# EAGLE design ECE411 Rough Draft Schematic (EAGLE 9.6.2)
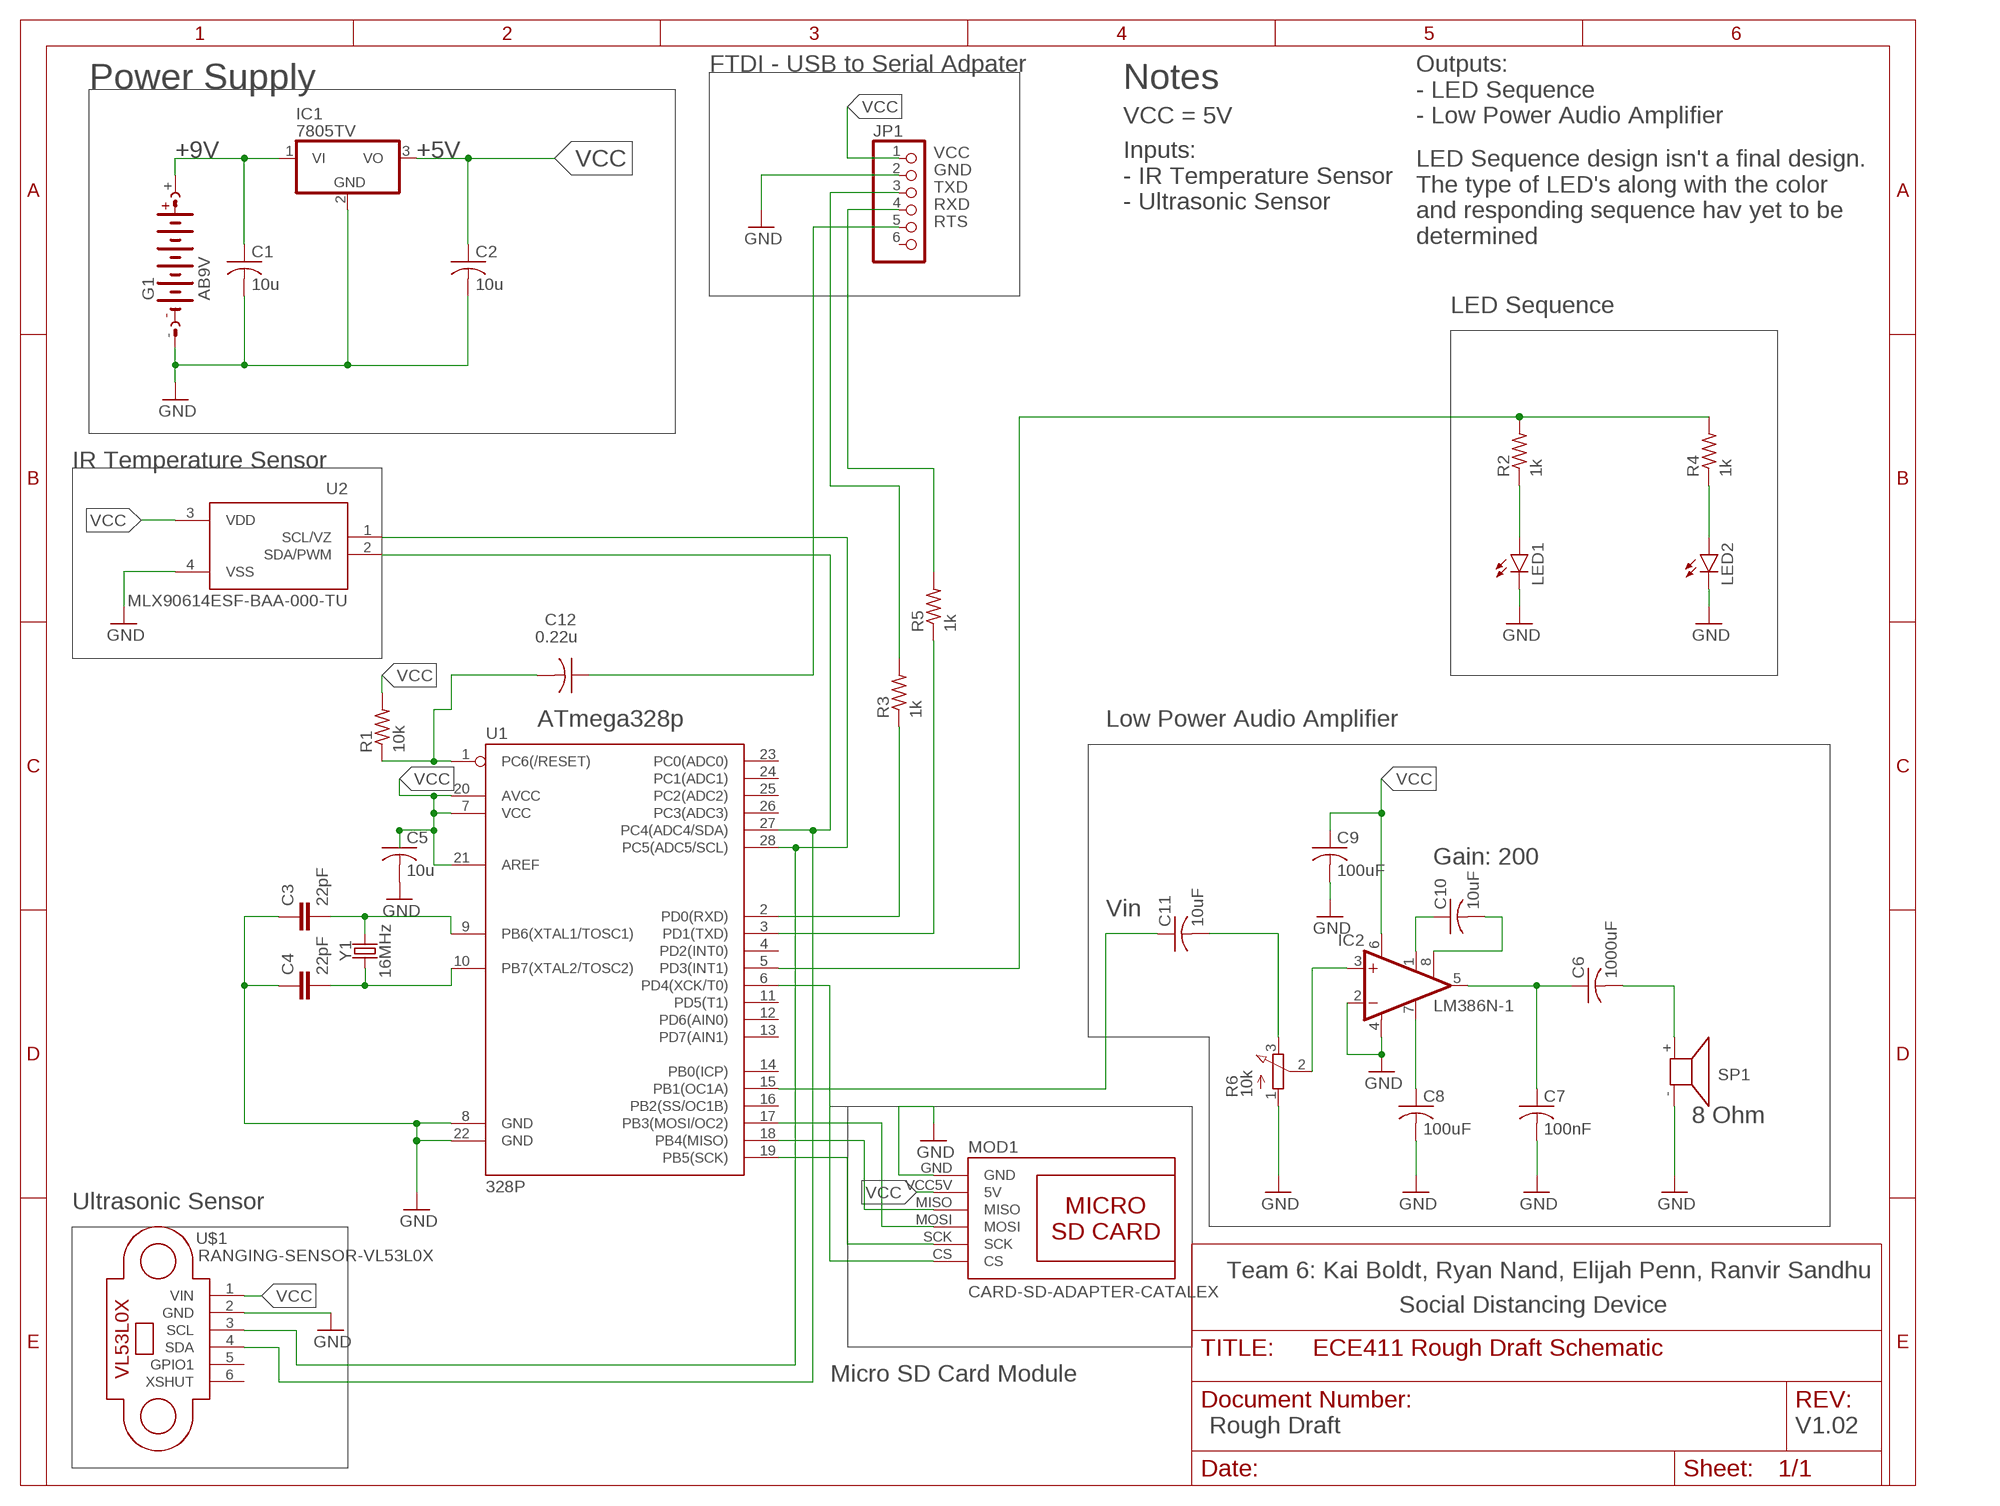
[diagram p0: schematic, sheet 1]

## Parts
C1  10u  C-US025-024X044  [C025-024X044]
C2  10u  C-US025-024X044  [C025-024X044]
C3  22pF  22PF-PTH-2.54MM-200V-5%  [CAP-PTH-2.54]
C4  22pF  22PF-PTH-2.54MM-200V-5%  [CAP-PTH-2.54]
C5  10u  C-US025-024X044  [C025-024X044]
C6  1000uF  C-US025-024X044  [C025-024X044]
C7  100nF  C-US025-024X044  [C025-024X044]
C8  100uF  C-US025-024X044  [C025-024X044]
C9  100uF  C-US025-024X044  [C025-024X044]
C10  10uF  C-US025-024X044  [C025-024X044]
C11  10uF  C-US025-024X044  [C025-024X044]
C12  0.22u  C-US050-030X075  [C050-030X075]
G1  AB9V  [AB9V]
IC1  7805TV  [TO220V]
IC2  LM386N-1  [DIL08]
JP1  PINHD-1X6  [1X06]
LED1  LED3MM  [LED3MM]
LED2  LED3MM  [LED3MM]
MOD1  CARD-SD-ADAPTER-CATALEX  [CARD-SD-ADAPTER-CATALEX]
R1  10k  R-US_0204/7  [0204/7]
R2  1k  R-US_0204/5  [0204/5]
R3  1k  R-US_0204/5  [0204/5]
R4  1k  R-US_0204/5  [0204/5]
R5  1k  R-US_0204/5  [0204/5]
R6  10k  3RP/1610N  [3RP/1610N]
SP1  KSS1201  [KSS1201]
U1  328P  ATMEGA328P_PDIP  [DIP28]
U2  MLX90614ESF-BAA-000-TU  [TO254P942H425-4]
U$1  RANGING-SENSOR-VL53L0X  [RANGING-SENSOR-VL53L0X]
Y1  16MHz  CRYSTAL-16MHZPTH-HC49US  [HC49US]

## Nets
+9V: C1.1 G1.+ IC1.1(VI)
CS: MOD1.CS U1.6(PD4(XCK/T0))
GND: C1.2 C2.2 C3.1 C4.1 C5.2 C7.2 C8.2 C9.2 G1.- IC1.2(GND) IC2.2(-IN) IC2.4(GND) JP1.2 LED1.K(C) LED2.K(C) MOD1.GND R6.1(A) SP1.- U1.8(GND) U1.22(GND) U2.4(VSS) U$1.2(GND)
MISO: MOD1.MISO U1.18(PB4(MISO))
MOSI: MOD1.MOSI U1.17(PB3(MOSI/OC2))
N$1: C3.2 U1.9(PB6(XTAL1/TOSC1)) Y1.2
N$2: C12.2 R1.1 U1.1(PC6(/RESET))
N$3: C4.2 U1.10(PB7(XTAL2/TOSC2)) Y1.1
N$8: C8.1 IC2.7(BYPASS)
N$9: C6.1 C7.1 IC2.5(OUT)
N$10: C10.2 IC2.8(GAIN)
N$11: IC2.3(+IN) R6.2(S)
N$12: C10.1 IC2.1(GAIN)
N$13: C11.2 R6.3(E)
N$14: C11.1 U1.15(PB1(OC1A))
N$20: R2.2 R4.2 U1.5(PD3(INT1))
N$21: LED1.A R2.1
N$22: LED2.A R4.1
N$23: R3.1 U1.2(PD0(RXD))
RTS: C12.1 JP1.5
RXD: JP1.4 R5.1 R5.2 U1.3(PD1(TXD))
SCK: MOD1.SCK U1.19(PB5(SCK))
SCL: U1.28(PC5(ADC5/SCL)) U2.1(SCL/VZ) U$1.3(SCL)
SDA: U1.27(PC4(ADC4/SDA)) U2.2(SDA/PWM) U$1.4(SDA)
TXD: JP1.3 R3.2
VCC: C2.1 C5.1 C9.1 IC1.3(VO) IC2.6(VS) JP1.1 MOD1.VCC5V(5V) R1.2 U1.7(VCC) U1.20(AVCC) U1.21(AREF) U2.3(VDD) U$1.1(VIN)
VO: C6.2 SP1.+
Unconnected: JP1.6 U1.4(PD2(INT0)) U1.11(PD5(T1)) U1.12(PD6(AIN0)) U1.13(PD7(AIN1)) U1.14(PB0(ICP)) U1.16(PB2(SS/OC1B)) U1.23(PC0(ADC0)) U1.24(PC1(ADC1)) U1.25(PC2(ADC2)) U1.26(PC3(ADC3)) U$1.5(GPIO1) U$1.6(XSHUT)

## Notes on the sheet
- FTDI - USB to Serial Adpater
- Power Supply | Notes
- VCC = 5V
- Outputs:
  - LED Sequence
  - Low Power Audio Amplifier
- +5V | VCC
- GND
- TXD
- RXD
- Inputs:
  - IR Temperature Sensor
  - Ultrasonic Sensor
- RTS
- LED Sequence design isn't a final design.
  The type of LED's along with the color 
  and responding sequence hav yet to be 
  determined
- LED Sequence
- IR Temperature Sensor
- ATmega328p | Low Power Audio Amplifier
- Gain: 200
- Vin
- 8 Ohm
- Ultrasonic Sensor
- Team 6: Kai Boldt, Ryan Nand, Elijah Penn, Ranvir Sandhu
- Social Distancing Device
- Micro SD Card Module
- Rough Draft | V1.02

## Library data of the parts
C1 C2 C5-C12 = rcl:C-US: CAPACITOR, American symbol; SPICEPREFIX: C
C3 C4 = SparkFun-Capacitors:22PF: 22pF ceramic capacitors A capacitor is a passive two-terminal electrical component used to store electrical energy temporarily in an electric field.; PROD_ID: CAP-09128
G1 = battery:AB9V: 9-V BATTERY CLIP
IC1 = linear:78*: Positive VOLTAGE REGULATOR Source: http://cache.national.com/ds/LM/LM78L05.pdf http://www.fairchildsemi.com/ds/LM/LM7805.pdf
IC2 = linear:LM386?-*: Low Voltage Audio Power Amplifier Source: http://cache.national.com/ds/LM/LM386.pdf
JP1 = pinhead:PINHD-1X6: PIN HEADER
LED1 LED2 = led:LED: LED OSRAM: - CHIPLED LG R971, LG N971, LY N971, LG Q971, LY Q971, LO R971, LY R971 LH N974, LH R974 LS Q976, LO Q976, LY Q976 LO Q996 - Hyper CHIPLED LW Q18S LB Q993, LB Q99A, LB R99A - SideLED LS A670, LO A670, LY A670, LG A670, LP A670 LB A673, LV A673, LT A673, LW A673 LH A674 LY A675 LS A676, LA A676, LO A676, LY A676, LW A676 LS A679, LY A679, LG A679 - Hyper Micro SIDELED® LS Y876, LA Y876, LO Y876, LY Y876 LT Y87S - SmartLED LW L88C, LW L88S LB L89C, LB L89S, LG L890 LS L89K, LO L89K, LY L89K LS L896, LA L896, LO L896, LY L896 - TOPLED LS T670, LO T670, LY T670, LG T670, LP T670 LSG T670, LSP T670, LSY T670, LOP T670, LYG T670 LG T671, LOG T671, LSG T671 LB T673, LV T673, LT T673, LW T673 LH T674 LS T676, LA T676, LO T676, LY T676, LB T676, LH T676, LSB T676, LW T676 LB T67C, LV T67C, LT T67C, LS T67K, LO T67K, LY T67K, LW E67C LS E67B, LA E67B, LO E67B, LY E67B, LB E67C, LV E67C, LT E67C LW T67C LS T679, LY T679, LG T679 LS T770, LO T770, LY T770, LG T770, LP T770 LB T773, LV T773, LT T773, LW T773 LH T774 LS E675, LA E675, LY E675, LS T675 LS T776, LA T776, LO T776, LY T776, LB T776 LHGB T686 LT T68C, LB T68C - Hyper Mini TOPLED® LB M676 - Mini TOPLED Santana® LG M470 LS M47K, LO M47K, LY M47K Source: http://www.osram.convergy.de LUXEON: - LUMILED® LXK2-PW12-R00, LXK2-PW12-S00, LXK2-PW14-U00, LXK2-PW14-V00 LXK2-PM12-R00, LXK2-PM12-S00, LXK2-PM14-U00 LXK2-PE12-Q00, LXK2-PE12-R00, LXK2-PE12-S00, LXK2-PE14-T00, LXK2-PE14-U00 LXK2-PB12-K00, LXK2-PB12-L00, LXK2-PB12-M00, LXK2-PB14-N00, LXK2-PB14-P00, LXK2-PB14-Q00 LXK2-PR12-L00, LXK2-PR12-M00, LXK2-PR14-Q00, LXK2-PR14-R00 LXK2-PD12-Q00, LXK2-PD12-R00, LXK2-PD12-S00 LXK2-PH12-R00, LXK2-PH12-S00 LXK2-PL12-P00, LXK2-PL12-Q00, LXK2-PL12-R00 Source: www.luxeon.com KINGBRIGHT: KA-3528ASYC Source: www.kingbright.com
MOD1 = SD-Card-Module_CATALEX:CARD-SD-ADAPTER-CATALEX: Micro SD Card Adapter Module with onboard 3.3V regulator
R1-R5 = rcl:R-US_: RESISTOR, American symbol; SPICEPREFIX: R
R6 = pot:3RP/1610N: 16mm Potentiometer one level Source: http://www.alphapotentiometers.net/html/16mm_pot_2.html
SP1 = buzzer:KSS1201: SPEAKER Source: Schukat; OC_FARNELL: unknown; OC_NEWARK: unknown
U1 = SparkFun-IC-Microcontroller:ATMEGA328P_PDIP: Atmel 328P Through hole ATMEGA328P uC used in the Arduino 32kb flash, 1k EEPROM, 2k SRAM Datasheet <http://www.sparkfun.com/datasheets/Components/SMD/ATMega328.pdf> SparkFun Products Storefront component: AVR 28 Pin 20MHz 32K 6A/D - ATMega328P <https://www.sparkfun.com/products/9061> (COM-09061) SparkFun Simon Says - Through-Hole Soldering Kit <https://www.sparkfun.com/products/10547> (KIT-10547) SparkFun Learn to Solder - Simon Says <https://www.sparkfun.com/products/13708> (KIT-13708) SparkFun BigTime Watch Kit <https://www.sparkfun.com/products/11734> (KIT-11734) SparkFun ClockIt <https://www.sparkfun.com/products/10930> (KIT-10930) SparkFun Serial Enabled LCD Kit <https://www.sparkfun.com/products/10097> (LCD-10097) SparkFun Simon Tilts - Through Hole Soldering Kit <https://www.sparkfun.com/products/12634> (KIT-12634) SparkFun Frequency Counter Kit <https://www.sparkfun.com/products/10140> (KIT-10140) FabFM Radio Kit <https://www.sparkfun.com/products/11043> (KIT-11043) SparkFun Binary Blaster Kit <https://www.sparkfun.com/products/12037> (KIT-12037) SparkFun Metro-Gnome <https://www.sparkfun.com/products/9236> (KIT-09236) ATmega328 with Arduino Optiboot (Uno) <https://www.sparkfun.com/products/10524> (DEV-10524); PROD_ID: IC-09136
U2 = MLX90614ESF-BAA-000-TU:MLX90614ESF-BAA-000-TU: Temperature Sensor Digital, Infrared (IR) -40°C ~ 85°C 16 b TO-39 Check prices <https://pricing.snapeda.com/parts/MLX90614ESF-BAA-000-TU/Melexis/view-part?ref=eda>; AVAILABILITY: Warning; DESCRIPTION: Temperature Sensor Digital, Infrared (IR) -40°C ~ 85°C 16 b TO-39; MF: Melexis; MP: MLX90614ESF-BAA-000-TU; PACKAGE: TO-39 Melexis; PRICE: None; PURCHASE-URL: https://pricing.snapeda.com/search/part/MLX90614ESF-BAA-000-TU/?ref=eda
U$1 = VL53L0X:RANGING-SENSOR-VL53L0X: Laser Ranging Sensor based on VL53L0X device More information about VL53L0X device can be found here: http://www.st.com/en/imaging-and-photonics-solutions/vl53l0x.html Arduino Library for VL53L0X is available here: https://github.com/pololu/vl53l0x-arduino Click here to find device on ebay.com <http://www.ebay.com/sch/GY+VL53L0X+module> Note: There are many variants. Search for the proper version.
Y1 = SparkFun-Clocks:CRYSTAL-16MHZ: 16MHz Crystal Digikey Example <http://www.digikey.com/product-search/en?keywords=535-9122-1-ND> Frequency: 16MHz Frequency Stability: ±50ppm Frequency Tolerance: ±20ppm Load Capacitance: 18pF SparkFun Products: Pro Micro -5V/16MHz <https://www.sparkfun.com/products/12640> SparkFun Serial Enabled LCD Kit <https://www.sparkfun.com/products/10097>; PROD_ID: XTAL-08181; SF_ID: COM-00536

## Board
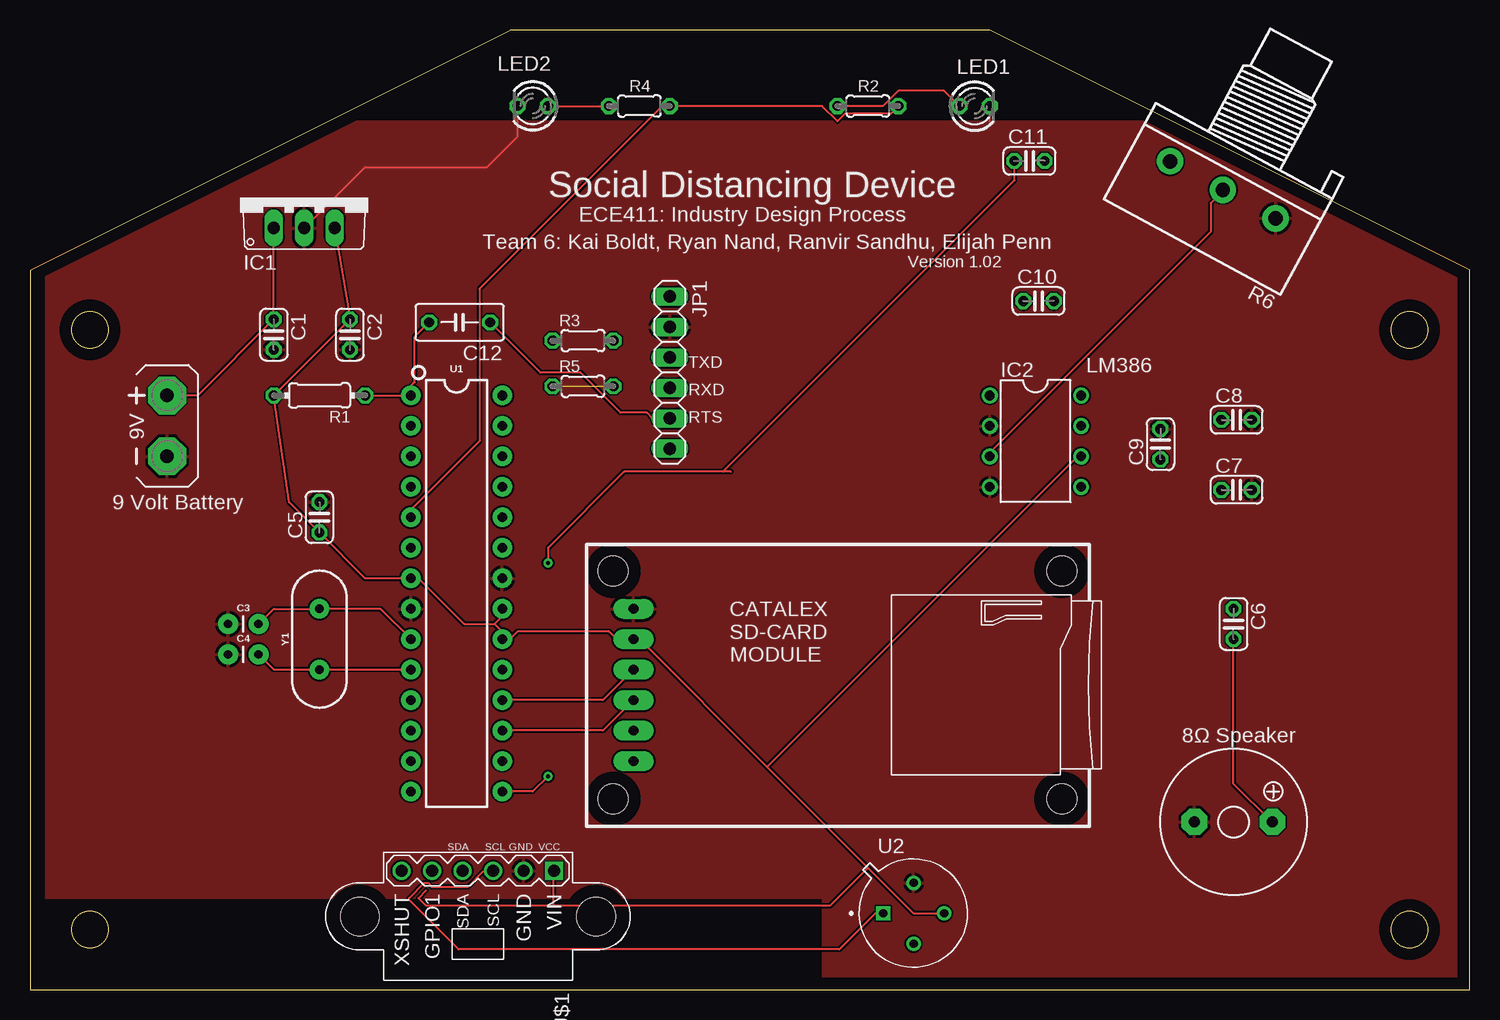
[diagram p1: board, top side]
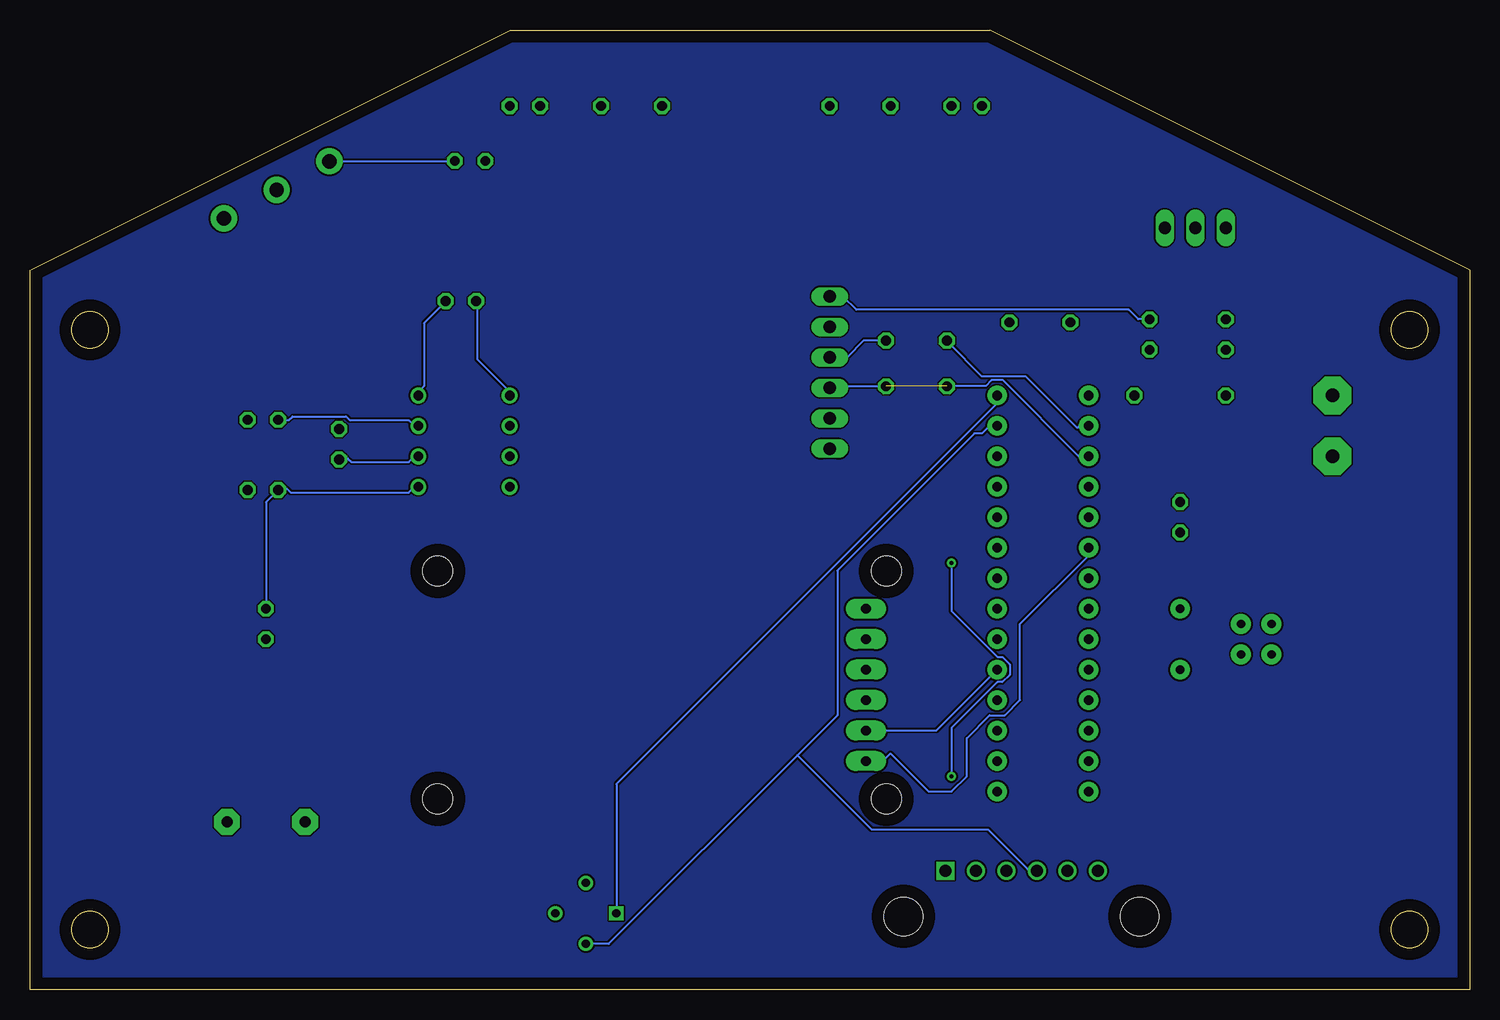
[diagram p2: board, bottom side, seen from below]

Size 120 x 80 mm. Coordinates in mm from the lower left corner, seen from the top.
Outline: 0,60 0,0 120,0 120,60 80,80 40,80 0,60
Outline: circle at 115,55 radius 1.5
Outline: circle at 5,55 radius 1.5
Outline: circle at 115,5 radius 1.5
Outline: circle at 5,5 radius 1.5
Copper layers (1*16): Top 0.035mm / dielectric 1.5mm / Bottom 0.035mm
Design rules "default": minimum track width 6mil, minimum drill 0.35mm, track to track 6mil, track to pad 6mil, pad to pad 6mil, via to via 6mil, smd to smd 6mil, copper to edge 40mil, drill to drill 6mil, minimum pad ring 10mil, minimum via ring 8mil, stop-mask expansion 4mil, vias tented up to drill 0mil, thermal gap 10mil

### Footprints (pad centres in the part's own frame; a part is rotated, then mirrored left to right if it is on the bottom)
C025-024X044 = drill 0.813 octagon: 1 -1.27,0; 2 1.27,0
CAP-PTH-2.54 = drill 0.7 pad 1.651: 1 -1.27,0; 2 1.27,0
C050-030X075 = drill 0.813 octagon: 1 -2.54,0; 2 2.54,0
AB9V = drill 1.118 pad 3.15 octagon: + 0,2.54; - 0,-2.54
TO220V = drill 1.016 long: 1 -2.54,-2.54; 2 0,-2.54; 3 2.54,-2.54
DIL08 = drill 0.813 pad 1.27: 1 -3.81,-3.81; 2 -1.27,-3.81; 3 1.27,-3.81; 4 3.81,-3.81; 5 3.81,3.81; 6 1.27,3.81; 7 -1.27,3.81; 8 -3.81,3.81
1X06 = drill 1.016 long: 1 -6.35,0; 2 -3.81,0; 3 -1.27,0; 4 1.27,0; 5 3.81,0; 6 6.35,0
LED3MM = drill 0.813 octagon: A -1.27,0; K 1.27,0
CARD-SD-ADAPTER-CATALEX = drill 0.8 pad 1.676 long: CS -17,-6.35; GND -17,6.35; MISO -17,1.27; MOSI -17,-1.27; SCK -17,-3.81; VCC5V -17,3.81 | hole 2.5: -18.7,9.5; 18.7,9.5; 18.7,-9.5; -18.7,-9.5
0204/7 = drill 0.813 octagon: 1 -3.81,0; 2 3.81,0
0204/5 = drill 0.813 octagon: 1 -2.54,0; 2 2.54,0
3RP/1610N = drill 1.2 pad 2.184: 1 -5,0; 2 0,0; 3 5,0
KSS1201 = drill 0.914 pad 2.159 octagon: + 3.251,0; - -3.251,0
DIP28 = drill 0.813 pad 1.626: 1 -16.51,-3.81; 2 -13.97,-3.81; 3 -11.43,-3.81; 4 -8.89,-3.81; 5 -6.35,-3.81; 6 -3.81,-3.81; 7 -1.27,-3.81; 8 1.27,-3.81; 9 3.81,-3.81; 10 6.35,-3.81; 11 8.89,-3.81; 12 11.43,-3.81; 13 13.97,-3.81; 14 16.51,-3.81; 15 16.51,3.81; 16 13.97,3.81; 17 11.43,3.81; 18 8.89,3.81; 19 6.35,3.81; 20 3.81,3.81; 21 1.27,3.81; 22 -1.27,3.81; 23 -3.81,3.81; 24 -6.35,3.81; 25 -8.89,3.81; 26 -11.43,3.81; 27 -13.97,3.81; 28 -16.51,3.81
TO254P942H425-4 = drill 0.69 pad 1.09 square: 1 -2.54,0 | drill 0.69 pad 1.09: 2 0,-2.54; 3 2.54,0; 4 0,2.54
RANGING-SENSOR-VL53L0X = drill 1 square: 1 -3.81,6.35 | drill 1: 2 -3.81,3.81; 3 -3.81,1.27; 4 -3.81,-1.27; 5 -3.81,-3.81; 6 -3.81,-6.35 | hole 3.2: 0,9.85; 0,-9.85
HC49US = drill 0.7 pad 1.651: 1 -2.54,0; 2 2.54,0

### Placement (x,y rotation side)
C1  20.32,54.61 270 top
C2  26.67,54.61 270 top
C3  17.78,30.48 0 top
C4  17.78,27.94 0 top
C5  24.13,39.37 90 top
C6  100.33,30.48 270 top
C7  100.58,41.66 0 top
C8  100.58,47.5 0 top
C9  94.23,45.47 90 top
C10  84.07,57.4 0 top
C11  83.31,69.09 0 top
C12  35.81,55.63 180 top
G1  11.43,46.99 0 top
IC1  22.86,66.04 0 top
IC2  83.82,45.72 270 top
JP1  53.34,51.44 270 top
LED1  78.74,73.66 0 top
LED2  41.91,73.66 180 top
MOD1  67.31,25.4 0 top
R1  24.13,49.53 180 top
R2  69.85,73.66 0 top
R3  46.1,54.1 0 top
R4  50.8,73.66 0 top
R5  46.1,50.29 0 top
R6  99.44,66.67 151.6 top
SP1  100.33,13.97 0 top
U1  35.56,33.02 270 top
U2  73.66,6.35 0 top
U$1  37.34,6.1 270 top
Y1  24.13,29.21 90 top

### Tracks (layer width: path | path; a pad name or v marks a point on that pad's centre or on a via)
+9V
  Top 0.152: G1.+ 13.97,49.53 C1.1 IC1.1
CS
  Bottom 0.152: U1.6 31.75,36.2 37.47,30.48 37.47,24.13 38.73,22.86 40.01,22.86 41.91,20.95 41.91,17.78 43.18,16.51 45.09,16.51 48.26,19.68 48.9,19.05 MOD1.CS
GND
  Top 0.152: IC1.2 27.94,68.58 38.1,68.58 40.64,71.12 LED2.K | 80.01,72.39 LED1.K
  pour Top: 119.38,59.69 93.98,72.39 26.67,72.39 1.27,59.69 1.27,7.62 66.04,7.62 66.04,0 119.38,0 119.38,58.42
MISO
  Top 0.152: MOD1.MISO 47.77,24.13 U1.18
MOSI
  Top 0.152: MOD1.MOSI 47.77,21.59 U1.17
N$1
  Top 0.152: U1.9 29.21,31.75 Y1.2 20.32,31.75 C3.2
N$2
  Top 0.152: R1.1 U1.1 31.75,50.32 32.07,50.64 32.07,54.45 33.18,55.56 C12.2
N$3
  Top 0.152: U1.10 Y1.1 20.32,26.67 C4.2
N$5
  pour Bottom: 120,0 0,0 0,60 40,80 80,80 120,60
N$8
  Bottom 0.152: IC2.7 87.95,46.99 88.42,47.47 93.34,47.47 93.66,47.78 98.11,47.78 98.42,47.47 99.22,47.47 C8.1
N$9
  Bottom 0.152: IC2.5 87.95,41.91 88.42,41.43 98.27,41.43 98.58,41.75 99.22,41.75 C7.1 100.33,40.64 C6.1
N$10
  Top 0.152: C10.2 85.34,56.77
  Bottom 0.152: IC2.8 87.63,49.85 87.15,50.32 87.15,55.56 85.41,57.31 C10.2
N$11
  Top 0.152: IC2.3 80.01,44.77 98.42,63.18 98.42,65.56 99.54,66.67 R6.2
N$12
  Top 0.152: C10.1 82.8,56.77
  Bottom 0.152: IC2.1 80.01,49.85 82.71,52.55 82.71,57.31 C10.1
N$13
  Bottom 0.152: C11.2 84.61,69.06 94.93,69.06 R6.3
N$14  (via drill 0.35)
  Top 0.152: 58.42,43.18 57.78,43.18 | 57.78,43.18 49.53,43.18 43.18,36.83 v43.18,35.56 | v43.18,17.78 41.91,16.51 U1.15 | 57.78,43.18 82.07,67.47 82.07,69.06 C11.1
  Bottom 0.152: v43.18,35.56 43.18,31.55 39.34,27.71 38.94,27.71 38.33,27.1 38.33,26.24 38.94,25.63 39.34,25.63 43.18,21.79 v43.18,17.78
N$20
  Top 0.152: R2.2 71.75,73.03 67.94,73.03 67.31,72.39 66.04,73.66 R4.2 52.7,73.66 37.47,58.42 37.47,45.72 31.75,40.01 U1.5
N$21
  Top 0.152: R2.1 71.12,73.66 72.39,74.93 76.2,74.93 LED1.A
N$22
  Top 0.152: LED2.A R4.1
N$23
  Bottom 0.152: U1.2 32.54,46.99 32.7,46.83 36.99,51.12 40.64,51.12 43.5,53.98 R3.1
RTS
  Top 0.152: C12.1 42.55,51.44 45.88,51.44 49.21,48.1 51.44,48.1 51.91,47.62 JP1.5
RXD  (1 unrouted)
  Bottom 0.152: U1.3 32.54,44.45 38.89,50.8 39.85,50.8 40.32,50.32 43.5,50.32 R5.1 | JP1.4 53.18,50.32 48.74,50.32 R5.2
SCK
  Bottom 0.152: MOD1.SCK 44.45,21.59 U1.19
SCL
  Top 0.152: U2.1 70.48,6.35 67.47,3.33 35.72,3.33 31.59,7.46 31.59,7.62 32.86,8.89 33.18,8.89 33.5,8.57 36.51,8.57 37.78,9.84 38.58,9.84 U$1.3
  Bottom 0.152: U2.1 71.12,17.14 39.37,48.9 U1.28
SDA
  Bottom 0.152: U2.2 71.75,3.81 56.04,19.53 | 56.04,19.53 52.7,22.86 52.7,34.92 41.27,46.35 40.64,46.35 40.01,46.99 U1.27 | 56.04,19.53 49.85,13.34 40.16,13.34 36.83,10 36.2,10 U$1.4
TXD
  Bottom 0.152: JP1.3 51.91,52.7 50.48,54.13 48.74,54.13 R3.2
VCC
  Top 0.152: IC1.3 C2.1 R1.2 21.59,40.64 C5.1 27.94,34.29 U1.7 32.38,34.29 36.2,30.48 38.73,30.48 | 38.73,30.48 39.37,29.84 U1.20 40.01,29.21 40.64,29.84 48.26,29.84 48.9,29.21 MOD1.VCC5V 50.8,29.21 61.44,18.57 | 38.73,30.48 39.37,31.11 U1.21 | C9.1 93.6,44.2 | U2.3 73.66,6.35 69.85,10.16 | 61.44,18.57 69.85,10.16 | 33.02,8.26 32.38,7.62 33.02,6.99 43.66,6.99 | 43.66,6.99 66.67,6.99 69.85,10.16 | 43.66,6.99 43.66,9.84 U$1.1 | IC2.6 87.31,44.45 61.44,18.57
  Bottom 0.152: IC2.6 87.95,44.45 88.42,43.97 93.19,43.97 93.5,44.29 94.14,44.29 C9.1 | JP1.1 52.23,57.78 51.12,56.67 28.42,56.67 27.62,55.88 C2.1
VO
  Top 0.152: C6.2 100.33,17.14 103.5,13.97 SP1.+

### Text on the board
tPlace: Social Distancing Device | ECE411: Industry Design Process | Team 6: Kai Boldt, Ryan Nand, Ranvir Sandhu, Elijah Penn | LM386 | 9 Volt Battery | 8Ω Speaker
tNames: Version 1.02 | TXD | RXD | RTS | SDA | SCL | GND | VCC